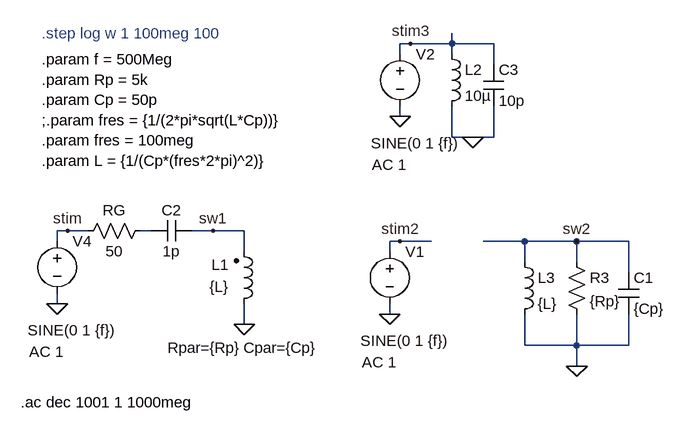
[diagram p0: schematic resonant.asc]
resonant.asc, the LTspice schematic file:
Version 4
SHEET 1 880 1328
WIRE -320 80 -336 80
WIRE -256 80 -256 64
WIRE -256 80 -320 80
WIRE -192 80 -256 80
WIRE -336 96 -336 80
WIRE -256 96 -256 80
WIRE -192 112 -192 80
WIRE -336 192 -336 176
WIRE -256 224 -256 176
WIRE -224 224 -256 224
WIRE -192 224 -192 176
WIRE -192 224 -224 224
WIRE -848 368 -864 368
WIRE -816 368 -848 368
WIRE -720 368 -736 368
WIRE -624 368 -656 368
WIRE -576 368 -624 368
WIRE -864 384 -864 368
WIRE -336 384 -352 384
WIRE -288 384 -336 384
WIRE -144 384 -208 384
WIRE -64 384 -144 384
WIRE 16 384 -64 384
WIRE -576 400 -576 368
WIRE -352 400 -352 384
WIRE -144 416 -144 384
WIRE -64 416 -64 384
WIRE 16 432 16 384
WIRE -864 480 -864 464
WIRE -352 496 -352 480
WIRE -576 512 -576 480
WIRE -144 544 -144 496
WIRE -64 544 -64 496
WIRE -64 544 -144 544
WIRE 16 544 16 496
WIRE 16 544 -64 544
WIRE -64 576 -64 544
FLAG -864 480 0
FLAG -64 576 0
FLAG -848 368 stim
FLAG -576 512 0
FLAG -352 496 0
FLAG -336 384 stim2
FLAG -624 368 sw1
FLAG -64 384 sw2
FLAG -336 192 0
FLAG -320 80 stim3
FLAG -224 224 0
SYMBOL ind2 -592 496 M180
WINDOW 0 -7 76 Right 2
WINDOW 3 -7 42 Right 2
WINDOW 39 133 -52 Right 2
SYMATTR InstName L1
SYMATTR Value {L}
SYMATTR Type ind
SYMATTR SpiceLine Rpar={Rp} Cpar={Cp}
SYMBOL voltage -864 368 R0
WINDOW 3 -45 153 Left 2
WINDOW 123 -43 186 Left 2
WINDOW 39 0 0 Left 2
SYMATTR InstName V4
SYMATTR Value SINE(0 1 {f})
SYMATTR Value2 AC 1
SYMBOL res -720 352 R90
WINDOW 0 0 56 VBottom 2
WINDOW 3 32 56 VTop 2
SYMATTR InstName RG
SYMATTR Value 50
SYMBOL ind -160 400 R0
SYMATTR InstName L3
SYMATTR Value {L}
SYMBOL res -80 400 R0
SYMATTR InstName R3
SYMATTR Value {Rp}
SYMBOL cap 0 432 R0
SYMATTR InstName C1
SYMATTR Value {Cp}
SYMBOL voltage -352 384 R0
WINDOW 3 -45 153 Left 2
WINDOW 123 -43 186 Left 2
WINDOW 39 0 0 Left 2
SYMATTR InstName V1
SYMATTR Value SINE(0 1 {f})
SYMATTR Value2 AC 1
SYMBOL cap -656 352 R90
WINDOW 0 0 32 VBottom 2
WINDOW 3 32 32 VTop 2
SYMATTR InstName C2
SYMATTR Value 1p
SYMBOL voltage -336 80 R0
WINDOW 3 -45 153 Left 2
WINDOW 123 -43 186 Left 2
WINDOW 39 0 0 Left 2
SYMATTR InstName V2
SYMATTR Value SINE(0 1 {f})
SYMATTR Value2 AC 1
SYMBOL ind -272 80 R0
SYMATTR InstName L2
SYMATTR Value 10µ
SYMBOL cap -208 112 R0
SYMATTR InstName C3
SYMATTR Value 10p
TEXT -920 632 Left 2 !.ac dec 1001 1 1000meg
TEXT -888 104 Left 2 !.param f = 500Meg\n.param Rp = 5k\n.param Cp = 50p\n;.param fres = {1/(2*pi*sqrt(L*Cp))}\n.param fres = 100meg\n.param L = {1/(Cp*(fres*2*pi)^2)}
TEXT -888 64 Left 2 ;.step log w 1 100meg 100

The netlist it stands for:
* resonant.asc
L1 0 sw1 {L} Rpar={Rp} Cpar={Cp}
V4 stim 0 SINE(0 1 {f}) AC 1
RG N001 stim 50
L3 sw2 0 {L}
R3 sw2 0 {Rp}
C1 sw2 0 {Cp}
V1 stim2 0 SINE(0 1 {f}) AC 1
C2 sw1 N001 1p
V2 stim3 0 SINE(0 1 {f}) AC 1
L2 stim3 0 10µ
C3 stim3 0 10p
.ac dec 1001 1 1000meg
.param f = 500Meg
.param Rp = 5k
.param Cp = 50p
;.param fres = {1/(2*pi*sqrt(L*Cp))}
.param fres = 100meg
.param L = {1/(Cp*(fres*2*pi)^2)}
* .step log w 1 100meg 100
.backanno
.end